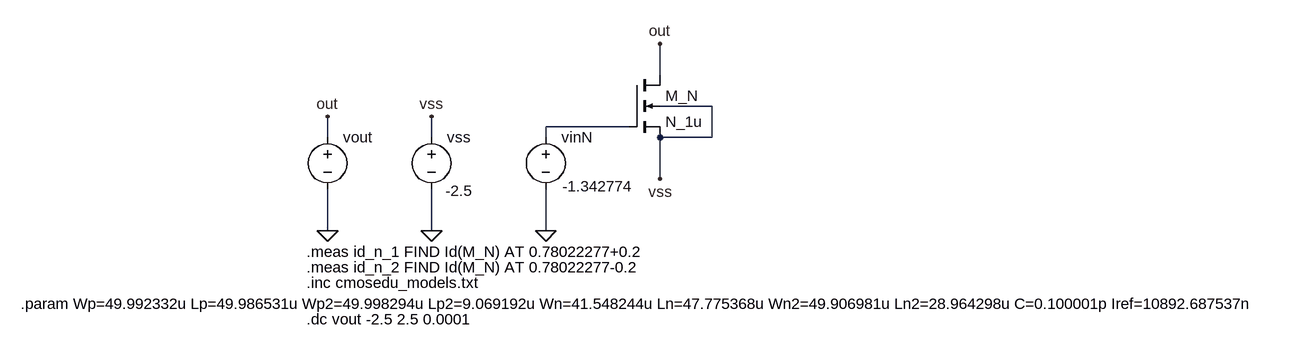
[diagram p0: schematic R6.asc]
R6.asc, the LTspice schematic file:
Version 4
SHEET 1 2140 680
WIRE 928 -112 928 -160
WIRE 1008 -64 928 -64
WIRE 880 -32 752 -32
WIRE 416 -16 416 -48
WIRE 576 -16 576 -48
WIRE 752 -16 752 -32
WIRE 1008 -16 1008 -64
WIRE 1008 -16 928 -16
WIRE 928 48 928 -16
WIRE 416 128 416 64
WIRE 576 128 576 64
WIRE 752 128 752 64
FLAG 752 128 0
FLAG 576 -48 vss
FLAG 576 128 0
FLAG 928 -160 out
FLAG 416 128 0
FLAG 416 -48 out
FLAG 928 48 vss
SYMBOL nmos4 880 -112 R0
SYMATTR InstName M_N
SYMATTR Value N_1u
SYMATTR Value2 l={Ln2} w={Wn2}
SYMBOL voltage 752 -32 R0
WINDOW 3 26 91 Left 2
WINDOW 123 0 0 Left 2
WINDOW 39 0 0 Left 2
SYMATTR Value -1.342774
SYMATTR InstName vinN
SYMBOL voltage 576 -32 R0
WINDOW 123 0 0 Left 2
WINDOW 39 0 0 Left 2
WINDOW 3 22 98 Left 2
SYMATTR Value -2.5
SYMATTR InstName vss
SYMBOL voltage 416 -32 R0
WINDOW 123 0 0 Left 2
WINDOW 39 0 0 Left 2
WINDOW 3 25 97 Left 2
SYMATTR Value ""
SYMATTR InstName vout
TEXT 384 208 Left 2 !.inc cmosedu_models.txt
TEXT 384 264 Left 2 !.dc vout -2.5 2.5 0.0001
TEXT 384 160 Left 2 !.meas id_n_1 FIND Id(M_N) AT 0.78022277+0.2
TEXT 384 184 Left 2 !.meas id_n_2 FIND Id(M_N) AT 0.78022277-0.2
TEXT -56 240 Left 2 !.param Wp=49.992332u Lp=49.986531u Wp2=49.998294u Lp2=9.069192u Wn=41.548244u Ln=47.775368u Wn2=49.906981u Ln2=28.964298u C=0.100001p Iref=10892.687537n

The netlist it stands for:
* R6.asc
M_N out N001 vss vss N_1u l={Ln2} w={Wn2}
vinN N001 0 -1.342774
vss vss 0 -2.5
vout out 0
.model NMOS NMOS
.model PMOS PMOS
.lib standard.mos
.inc cmosedu_models.txt
.dc vout -2.5 2.5 0.0001
.meas id_n_1 FIND Id(M_N) AT 0.78022277+0.2
.meas id_n_2 FIND Id(M_N) AT 0.78022277-0.2
.param Wp=49.992332u Lp=49.986531u Wp2=49.998294u Lp2=9.069192u Wn=41.548244u Ln=47.775368u Wn2=49.906981u Ln2=28.964298u C=0.100001p Iref=10892.687537n
.backanno
.end

* Results of the author's LTspice run, read from the files saved beside the schematic
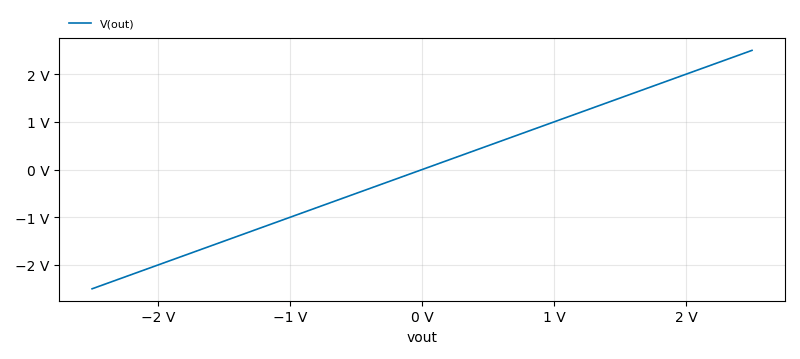
[diagram p1: DC transfer characteristic of R6.asc, plotted from the saved traces]
* DC transfer characteristic, 1 run:
*   V(out): -2.5 V at vout=-2.5 V, 2.5 V at vout=2.5 V, min -2.5 V, max 2.5 V